# EAGLE design Mainsch (EAGLE 9.6.2)
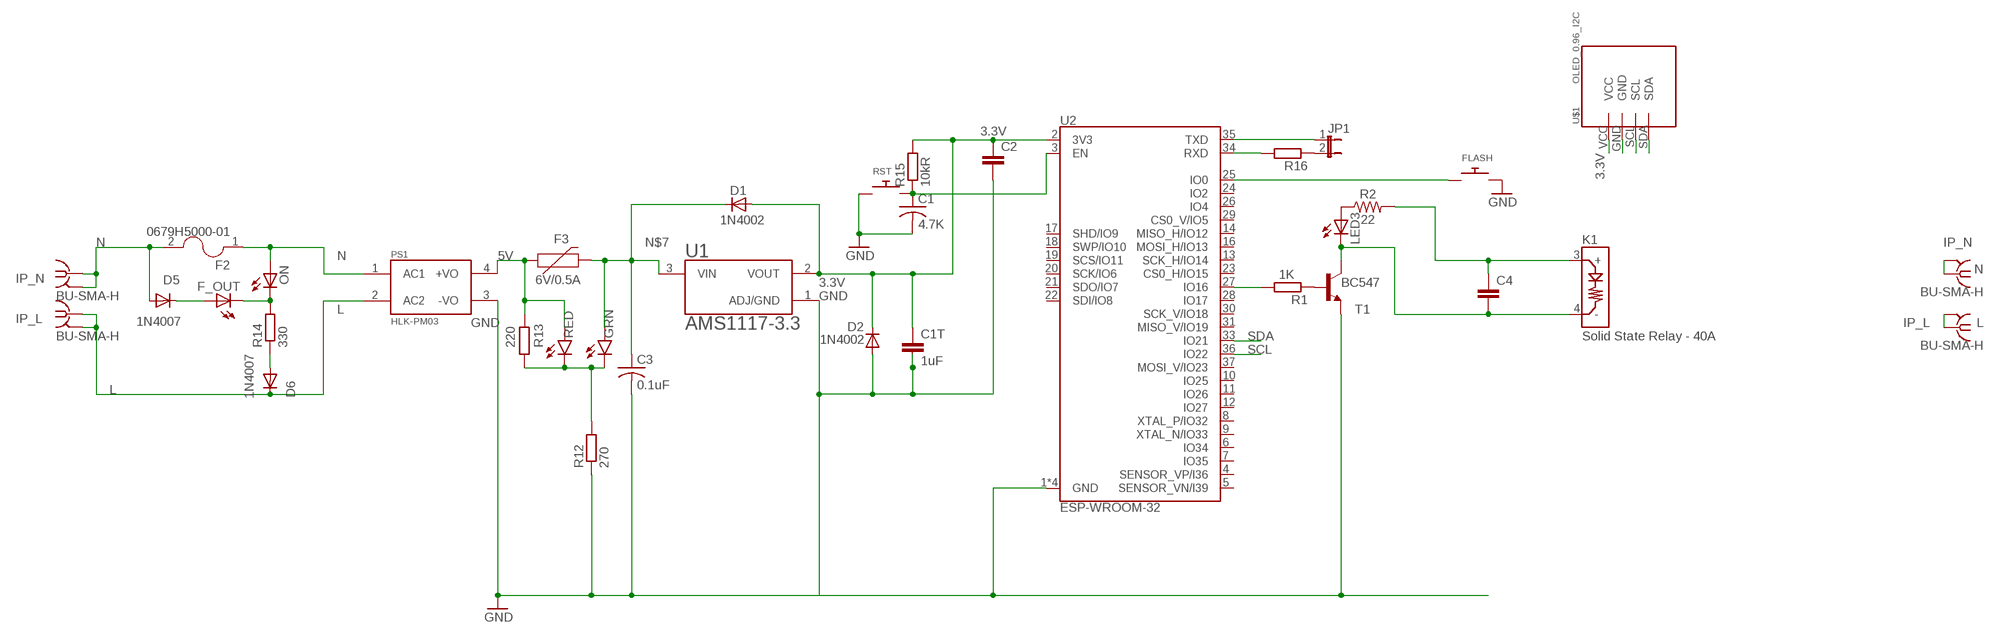
[diagram p0: schematic, sheet 1]

## Parts
C1  4.7K  C-USC0805K  [C0805K]
C1T  1uF  C-EUC0805  [C0805]
C2  C-EUC0805  [C0805]
C3  0.1uF  C-USC0805K  [C0805K]
C4  C-EUC0805  [C0805]
D1  1N4002  1N4004  [DO41-10]
D2  1N4002  1N4004  [DO41-10]
D5  1N4007  1N4004  [DO41-10]
D6  1N4007  1N4004  [DO41-10]
F2  0679H5000-01  [FUSC6125X279N]
F3  6V/0.5A  PPTC_6V500MA-2  [1206]
F_OUT  LEDCHIPLED_1206  [CHIPLED_1206]
FLASH  SWITCH_PUSHBUTTONC&K_KSS  [BTN_CK_KSS]
GRN  LED1206  [LED-1206]
IP_L  BU-SMA-H  [BU-SMA-H]
IP_N  BU-SMA-H  [BU-SMA-H]
JP1  JP1E  [JP1]
K1  Solid State Relay - 40A  SOLID_STATE_RELAY_SSR-40DA-H  [SSR-40DA-H]
L  BU-SMA-H  [BU-SMA-H]
LED3  LEDCHIPLED_1206  [CHIPLED_1206]
N  BU-SMA-H  [BU-SMA-H]
ON  LEDCHIPLED_1206  [CHIPLED_1206]
PS1  HLK-PM03  [CONV_HLK-PM03]
R1  1K  R-EU_R1206  [R1206]
R2  22  22OHM-0603-1/10W-1%  [0603]
R12  270  R-EU_R0805  [R0805]
R13  220  R-EU_R0805  [R0805]
R14  330  R-EU_R0805  [R0805]
R15  10kR  R-EU_R0805  [R0805]
R16  R-EU_R0805  [R0805]
RED  LED1206  [LED-1206]
RST  SWITCH_PUSHBUTTONC&K_KSS  [BTN_CK_KSS]
T1  BC547  [TO92]
U1  AMS1117-3.3  [SOT229P700X180-4N]
U2  ESP-WROOM-32  [ESP-WROOM-32]
U$1  OLED_0.96_I2C  [OLED_0.96_I2C]

## Nets
3.3V [dc]: C1T.1 C2.1 D1.A D2.C R15.2 U1.2(VOUT) U2.2(3V3) U$1.VCC
5V [dc]: F3.1 PS1.4(+VO) R13.2 RED.A
GND [dc]: C1.2 C1T.2 C2.2 C3.2 D2.A FLASH.P$2 PS1.3(-VO) R12.1 RST.P$1 T1.1(E) U1.1(ADJ/GND) U2.1(GND) U2.15(GND) U2.38(GND) U2.GND U$1.GND
IP_L [ac]: L.1 L.2 L.3 L.4 L.5
IP_N [ac]: N.1 N.2 N.3 N.4 N.5
L [ac]: D6.C IP_L.1 IP_L.2 IP_L.3 IP_L.4 IP_L.5 PS1.2(AC2)
N [ac]: D5.A F2.1 F2.2 IP_N.1 IP_N.2 IP_N.3 IP_N.4 IP_N.5 ON.A PS1.1(AC1)
N$1: JP1.2 R16.1
N$2: C4.2 K1.4(-) LED3.C T1.3(C)
N$3: R1.2 U2.27(IO16)
N$4: LED3.A R2.1
N$5: D6.A R14.1
N$7: C3.1 D1.C F3.2 GRN.A U1.3(VIN)
N$9: JP1.1 U2.35(TXD)
N$11: R16.2 U2.34(RXD)
N$14: FLASH.P$1 U2.25(IO0)
N$16: C1.1 R15.1 RST.P$2 U2.3(EN)
N$17: R1.1 T1.2(B)
N$18: F_OUT.C ON.C R14.2
N$21: D5.C F_OUT.A
N$24: GRN.C R12.2 R13.1 RED.C
N$25: C4.1 K1.3(+) R2.2
SCL: U2.36(IO22) U$1.SCL
SDA: U2.33(IO21) U$1.SDA
Unconnected: U2.4(SENSOR_VP/I36) U2.5(SENSOR_VN/I39) U2.6(IO34) U2.7(IO35) U2.8(XTAL_P/IO32) U2.9(XTAL_N/IO33) U2.10(IO25) U2.11(IO26) U2.12(IO27) U2.13(SCK_H/IO14) U2.14(MISO_H/IO12) U2.16(MOSI_H/IO13) U2.17(SHD/IO9) U2.18(SWP/IO10) U2.19(SCS/IO11) U2.20(SCK/IO6) U2.21(SDO/IO7) U2.22(SDI/IO8) U2.23(CS0_H/IO15) U2.24(IO2) U2.26(IO4) U2.28(IO17) U2.29(CS0_V/IO5) U2.30(SCK_V/IO18) U2.31(MISO_V/IO19) U2.37(MOSI_V/IO23)

## Library data of the parts
C1 C3 = adafruit:C-US: CAPACITOR, American symbol
C1T C2 C4 = rcl:C-EU: CAPACITOR, European symbol
D1 D2 = diode:1N4004: DIODE
D5 D6 = adafruit:1N4004: DIODE
F2 = ac_fuse:0679H5000-01: 2410 SMT Fuse | Quick Acting | 250mA | Higher AC Voltage Check prices <https://pricing.snapeda.com/parts/0679H5000-01/Bel%20Fuse/view-part?ref=eda>; AVAILABILITY: Good; DESCRIPTION: 2410 SMT Fuse | Quick Acting | 5A | Higher AC Voltage; MF: Bel Fuse; MP: 0679H5000-01; PACKAGE: SMD-2 Bel Fuse; PRICE: None; PURCHASE-URL: https://pricing.snapeda.com/search/part/0679H5000-01/?ref=eda
F3 = SparkFun-Fuses:PPTC: Resettable Fuse PPTC Resettable Fuse. Really a sort of resistor with a polymeric positive temperature coefficient whose resistance increases dramatically with an increase in temperature. When heated by the power passing through the resistance rises causing the current to be limited, protecting the circuit. This is achieved by the transition of the polymer from a crystalline to an amorphous state where the conductive carbon separates breaking the conductive pathways found in the cool crystalline structure. When a PPTC cools back down it resumes conducting letting the circuit turn back on. SparkFun Products: SparkFun RedBoard - Programmed with Arduino <https://www.sparkfun.com/products/12757> Pro Micro - 5V/16MHz <https://www.sparkfun.com/products/12640> Arduino Pro 328 - 5V/16MHz <https://www.sparkfun.com/products/10915> MP3 Trigger <https://www.sparkfun.com/products/13720>; PROD_ID: RES-08585
F_OUT LED3 ON = adafruit:LED: LED OSRAM: - CHIPLED LG R971, LG N971, LY N971, LG Q971, LY Q971, LO R971, LY R971 LH N974, LH R974 LS Q976, LO Q976, LY Q976 LO Q996 - Hyper CHIPLED LW Q18S LB Q993, LB Q99A, LB R99A - SideLED LS A670, LO A670, LY A670, LG A670, LP A670 LB A673, LV A673, LT A673, LW A673 LH A674 LY A675 LS A676, LA A676, LO A676, LY A676, LW A676 LS A679, LY A679, LG A679 - Hyper Micro SIDELED® LS Y876, LA Y876, LO Y876, LY Y876 LT Y87S - SmartLED LW L88C, LW L88S LB L89C, LB L89S, LG L890 LS L89K, LO L89K, LY L89K LS L896, LA L896, LO L896, LY L896 - TOPLED LS T670, LO T670, LY T670, LG T670, LP T670 LSG T670, LSP T670, LSY T670, LOP T670, LYG T670 LG T671, LOG T671, LSG T671 LB T673, LV T673, LT T673, LW T673 LH T674 LS T676, LA T676, LO T676, LY T676, LB T676, LH T676, LSB T676, LW T676 LB T67C, LV T67C, LT T67C, LS T67K, LO T67K, LY T67K, LW E67C LS E67B, LA E67B, LO E67B, LY E67B, LB E67C, LV E67C, LT E67C LW T67C LS T679, LY T679, LG T679 LS T770, LO T770, LY T770, LG T770, LP T770 LB T773, LV T773, LT T773, LW T773 LH T774 LS E675, LA E675, LY E675, LS T675 LS T776, LA T776, LO T776, LY T776, LB T776 LHGB T686 LT T68C, LB T68C - Hyper Mini TOPLED® LB M676 - Mini TOPLED Santana® LG M470 LS M47K, LO M47K, LY M47K Source: http://www.osram.convergy.de/
FLASH RST = adafruit:SWITCH_PUSHBUTTON: Buttons SOFTTOUCHSMD_SJ - Soft touch temporary push button (Super Junk Akihabara) Compatible with SKPMANE010 [Mouser: 688-SKPMAN] C&K_KSS = Digikey: KSS221GLFS
GRN RED = SparkFun-LED:LED: LED (Generic) Standard schematic elements and footprints for 5mm, 3mm, 1206, and 0603 sized LEDs. Generic LEDs with no color specified.
IP_L IP_N L N = con-coax:BU-SMA-H: FEMALE SMA CONNECTOR Radiall; OC_FARNELL: unknown; OC_NEWARK: unknown
JP1 = jumper:JP1E: JUMPER
K1 = SparkFun-DiscreteSemi:SOLID_STATE_RELAY_SSR-40DA-H: Fotek SSR-40DA-H DC->AC Solid State Relay This particular SSR can switch current loads of up to 40A with a 3-32V DC input and a zero cross trigger control method. Each one of these relays is equipped with four screw terminals (for use with ring or fork connectors) and a plastic cover that slides over the top of the relay to protect the terminals.; PROD_ID: COMP-15116, CONN-08399, 2 x HW-15038
PS1 = HLK-PM03:HLK-PM03: AC DC 3W power module; AVAILABILITY: Unavailable; MF: Hi-link; MP: HLK-PM03; PACKAGE: Package; PRICE: None
R1 = resistor:R-EU_: RESISTOR, European symbol
R2 = SparkFun-Resistors:22OHM: 22Ω resistor A resistor is a passive two-terminal electrical component that implements electrical resistance as a circuit element. Resistors act to reduce current flow, and, at the same time, act to lower voltage levels within circuits. - Wikipedia; PROD_ID: RES-08698
R12-R16 = rcl:R-EU_: RESISTOR, European symbol; SPICEPREFIX: R
T1 = transistor:BC547: NPN TRANSISTOR
U1 = AMS1117-3.3:AMS1117-3.3: Sot223/Pkg 1-Amp 3.3-Volt Low Drop Out Voltage Regulatator; AVAILABILITY: Unavailable; DESCRIPTION: LDO Voltage Regulators 800MA LDO LINEAR REG; MF: AMD; MP: AMS1117-3.3; PACKAGE: None; PRICE: None
U2 = SparkFun-RF:ESP-WROOM-32; PROD_ID: IC-13849
U$1 = oled_0_96:OLED_0.96_I2C

## Net classes
0 default: width 0.381 mm
1 dc: width 0.406 mm
2 ac: width 3.556 mm

## Board
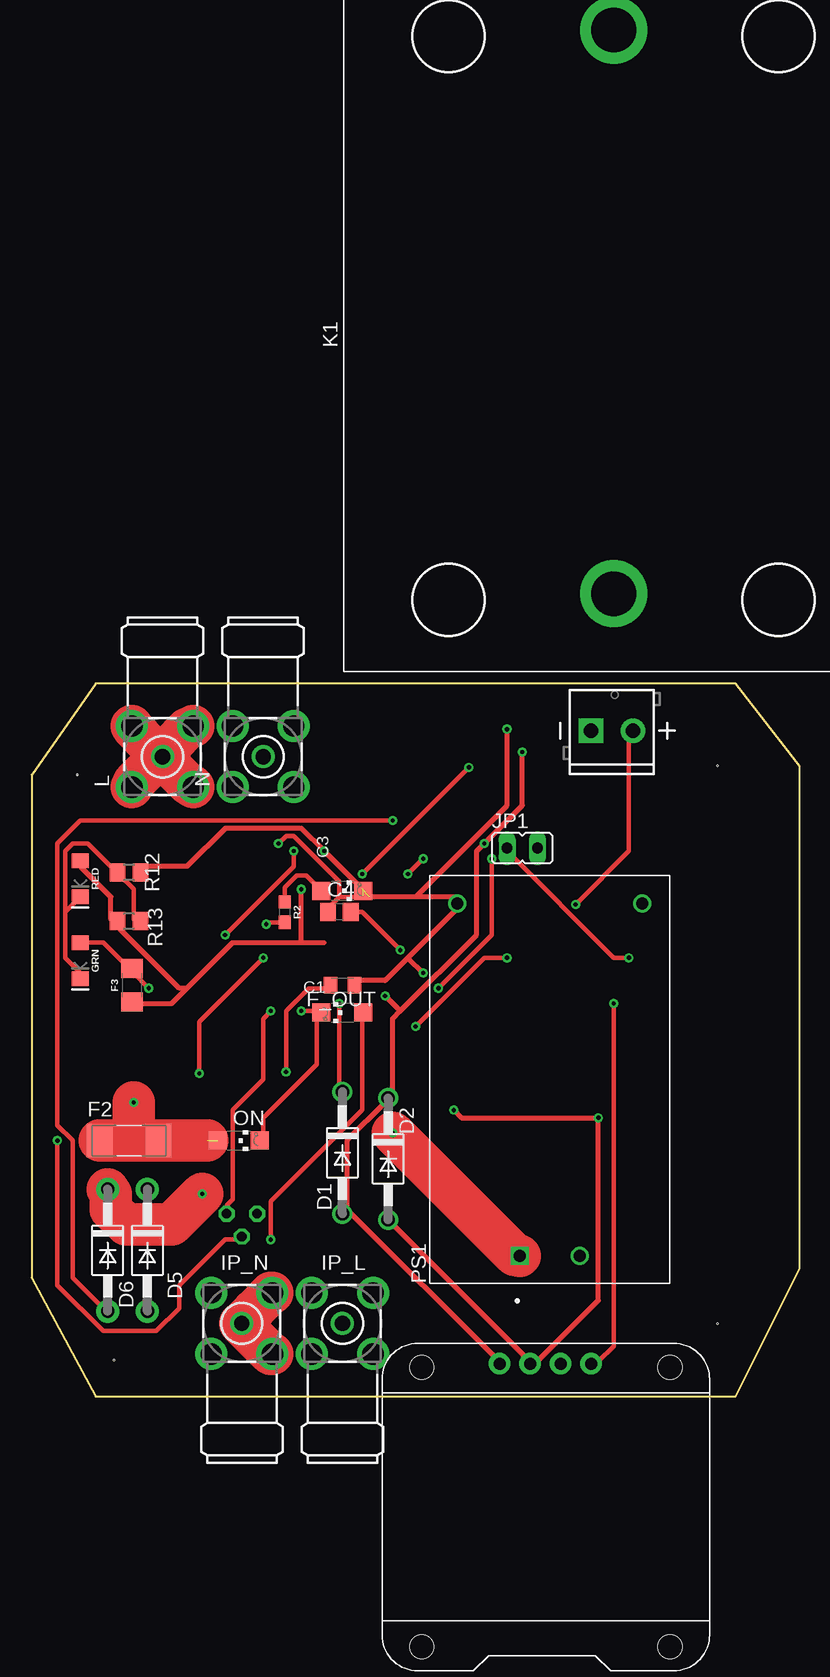
[diagram p1: board, top side]
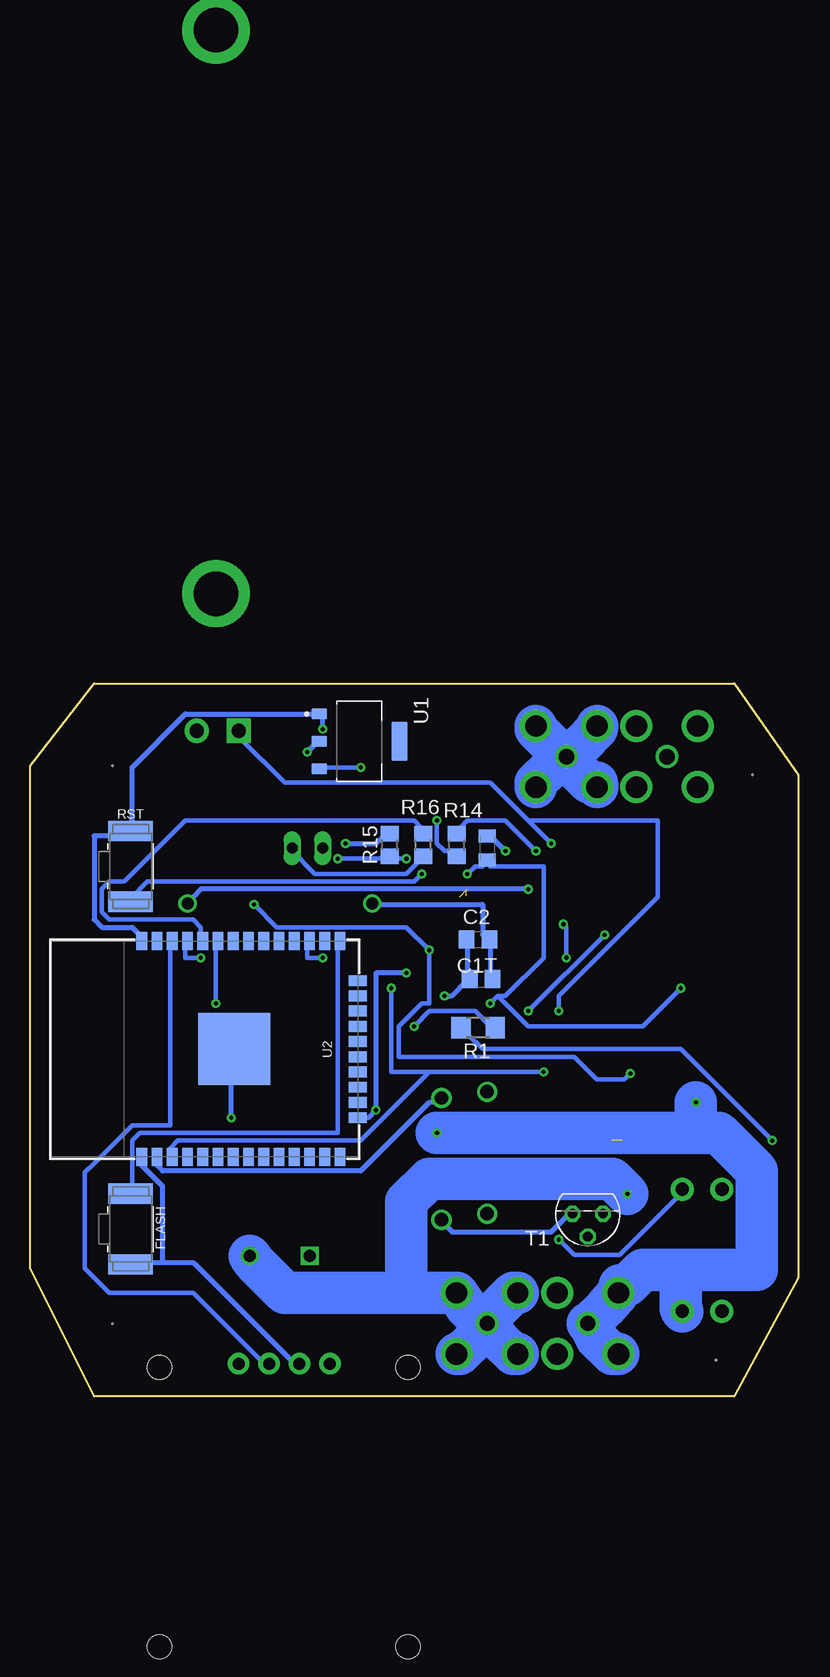
[diagram p2: board, bottom side, seen from below]

Size 64.01 x 59.44 mm. Coordinates in mm from the lower left corner, seen from the top.
Outline: 0,9.91 5.33,0 58.67,0 64.01,10.67 64.01,52.58 58.67,59.44 5.33,59.44 0,51.82 0,9.91
Copper layers (1*16): Top 0.035mm / dielectric 1.5mm / Bottom 0.035mm
Design rules "default": minimum track width 6mil, minimum drill 0.35mm, track to track 6mil, track to pad 6mil, pad to pad 6mil, via to via 6mil, smd to smd 6mil, copper to edge 40mil, drill to drill 6mil, minimum pad ring 10mil, minimum via ring 8mil, stop-mask expansion 4mil, vias tented up to drill 0mil, thermal gap 10mil
Holes 0.11 mm at 6.86,3.05 3.81,51.82 57.15,52.58 57.15,6.1

### Footprints (pad centres in the part's own frame; a part is rotated, then mirrored left to right if it is on the bottom)
C0805K = smd 1.1 x 1.4: 1 -1,0; 2 1,0
C0805 = smd 1.3 x 1.5: 1 -0.95,0; 2 0.95,0
DO41-10 = drill 1.118: A 5.08,0; C -5.08,0
DO41-10' = drill 1.118 pad 1.93: A 5.08,0; C -5.08,0
FUSC6125X279N = smd 2.15 x 2.8: 1 -2.455,0; 2 2.455,0
1206 = smd 1.6 x 1.8: 1 -1.4,0; 2 1.4,0
CHIPLED_1206 = smd 1.5 x 1.5: A 0,-1.75; C 0,1.75
BTN_CK_KSS = smd 1.7 x 3.7: P$1 -2.95,0; P$2 2.95,0
LED-1206 = smd 1.2 x 1.4: A -1.5,0; C 1.5,0
BU-SMA-H = drill 1.27: 1 0,0 | drill 1.778: 2 -2.55,2.55; 3 2.55,2.55; 4 2.55,-2.55; 5 -2.55,-2.55
JP1 = drill 0.914 long: 1 0,-1.27; 2 0,1.27
SSR-40DA-H = drill 1.2 pad 2.032: 3 -34.925,-1.595 | drill 1.2 pad 2.032 square: 4 -34.925,1.905 | drill 3.73 pad 5.6: H1 -23.5,0; H2 23.49,0
CONV_HLK-PM03 = drill 1 square: 1 -14.7,2.5 | drill 1: 2 -14.7,-2.5; 3 14.7,7.7; 4 14.7,-7.7
R1206 = smd 1.6 x 1.803: 1 -1.422,0; 2 1.422,0
0603 = smd 1.1 x 1: 1 -0.85,0; 2 0.85,0
R0805 = smd 1.3 x 1.5: 1 -0.95,0; 2 0.95,0
TO92 = drill 0.813 octagon: 1 1.27,0; 2 0,1.905; 3 -1.27,0
SOT229P700X180-4N = smd 0.93 x 1.31: 1 -2.29,-3.345; 2 0,-3.345; 3 2.29,-3.345 | smd 3.24 x 1.31: 4 0,3.345
ESP-WROOM-32 = smd 0.9 x 1.5: 1 7.7,9; 2 6.43,9; 3 5.16,9; 4 3.89,9; 5 2.62,9; 6 1.35,9; 7 0.08,9; 8 -1.19,9; 9 -2.46,9; 10 -3.73,9; 11 -5,9; 12 -6.27,9; 13 -7.54,9; 14 -8.81,9; 25 -8.81,-9; 26 -7.54,-9; 27 -6.27,-9; 28 -5,-9; 29 -3.73,-9; 30 -2.46,-9; 31 -1.19,-9; 32 0.08,-9; 33 1.35,-9; 34 2.62,-9; 35 3.89,-9; 36 5.16,-9; 37 6.43,-9; 38 7.7,-9 | smd 1.5 x 0.9: 15 -10.3,5.715; 16 -10.3,4.445; 17 -10.3,3.175; 18 -10.3,1.905; 19 -10.3,0.635; 20 -10.3,-0.635; 21 -10.3,-1.905; 22 -10.3,-3.175; 23 -10.3,-4.445; 24 -10.3,-5.715 | smd 6 x 6: GND 0,0
OLED_0.96_I2C = drill 1 pad 1.778: GND -1.63,11.63; SCL 0.91,11.63; SDA 3.45,11.63; VCC -4.17,11.63 | hole 2: -10.67,-11.97; 10.03,-11.97; 10.03,11.33; -10.67,11.33

### Placement (x,y rotation side)
C1  25.91,34.29 0 top
C1T  26.42,34.8 0 bottom
C2  26.67,38.1 0 bottom
C3  25.91,45.72 90 bottom
C4  25.65,40.39 180 top
D1  25.91,20.32 270 top
D2  29.72,19.81 270 top
D5  1N4007  [DO41-10']  9.65,12.19 270 top
D6  1N4007  [DO41-10']  6.35,12.19 270 top
F2  8.13,21.34 0 top
F3  8.38,34.29 90 top
F_OUT  25.91,32 90 top
FLASH  55.63,13.97 270 bottom
GRN  4.06,36.32 270 top
IP_L  25.91,6.1 270 top
IP_N  17.53,6.1 270 top
JP1  40.89,45.72 270 top
K1  48.51,90.42 90 top
L  10.92,53.34 90 top
LED3  25.91,42.16 270 top
N  19.3,53.34 90 top
ON  17.27,21.34 270 top
PS1  43.18,26.42 90 top
R1  26.67,30.73 0 bottom
R2  21.08,40.39 270 top
R12  8.13,43.69 180 top
R13  8.13,39.62 180 top
R14  28.45,45.97 90 bottom
R15  34.04,45.97 90 bottom
R16  31.24,45.97 90 bottom
RED  4.06,43.18 270 top
RST  55.63,44.2 270 bottom
T1  17.53,15.24 180 bottom
U1  36.58,54.61 270 bottom
U2  46.99,28.96 180 bottom
U$1  43.18,-8.89 0 top

### Tracks (layer width: path | path; a pad name or v marks a point on that pad's centre or on a via)
3.3V  (via drill 0.35)
  Top 0.406: v40.89,53.72 40.89,49.28 v37.72,46.1 37.08,45.47 37.08,38.48 30.73,32.13 | 30.73,32.13 30.1,31.5 30.1,25.15 D2.C 29.46,24.51 26.29,21.34 26.29,15.62 | 30.73,32.13 v29.46,33.4 | 26.29,15.62 38.99,2.92 U$1.VCC | 26.29,15.62 D1.A
  Bottom 0.406: C2.1 27.56,37.85 27.56,35.31 C1T.1 27.56,34.67 28.83,33.4 v29.46,33.4 | v40.89,53.72 40.26,54.36 U1.2 | U2.2 53.59,19.43 52.96,18.8 36.45,18.8 30.73,24.51 30.1,24.51 D2.C | v37.72,46.1 35.18,46.1 34.54,46.74 R15.2
5V  (via drill 0.35)
  Top 0.406: RED.A 4.06,44.2 6.6,41.66 6.6,39.75 R13.2 7.24,39.12 12.32,34.04 12.95,34.04 | 22.48,37.85 16.76,37.85 12.95,34.04 | 22.48,37.85 24.38,37.85 | 12.95,34.04 11.68,32.77 8.51,32.77 F3.1 | 22.48,37.85 v22.48,42.29
  Bottom 0.406: v22.48,42.29 49.78,42.29 50.42,41.66 PS1.4
GND  (via drill 0.35)  (1 unrouted)
  Top 0.406: D2.A 41.53,2.92 U$1.GND 42.16,2.92 47.24,8 v47.24,23.24 35.81,23.24 v35.18,23.88 | 27.56,42.29 v24.38,45.47 22.48,47.37 16.13,47.37 12.95,44.2 9.14,44.2 R12.1 | 31.37,36.58 35.81,41.02 PS1.3 35.18,41.66 32,41.66 | 31.37,36.58 29.46,34.67 26.92,34.67 C1.2 | 31.37,36.58 v32.64,35.31 | 32,41.66 28.19,41.66 | v39.62,55.63 39.62,49.28 32,41.66
  Bottom 0.406: T1.1 19.3,14.99 20.57,13.72 28.83,13.72 29.46,14.35 D2.A | 52.96,11.18 52.96,17.53 54.86,19.43 U2.1 | 52.96,11.18 55.5,11.18 FLASH.P$2 | 52.96,11.18 50.42,11.18 42.16,2.92 U$1.GND | v47.24,23.24 47.24,28.96 U2.GND | U2.38 54.86,38.48 55.5,39.12 58.04,39.12 58.67,39.75 58.67,46.74 56.13,46.74 RST.P$1 55.5,47.37 55.5,52.45 51.05,56.9 40.26,56.9 U1.1 39.62,56.9 v39.62,55.63 | v24.38,45.47 25.65,46.74 C3.2 | C1T.2 25.65,35.31 25.65,37.85 C2.2 26.29,38.48 26.29,41.02 35.18,41.02 PS1.3 | U2.15 35.81,23.24 v35.18,23.88 35.18,35.31 v32.64,35.31
IP_L
  Top 3.556: 11.05,53.09 12.95,51.18 L.5 | 11.05,53.09 L.1 9.78,54.36 8.51,55.63 L.3 | L.2 8.51,51.18 9.78,52.45 11.05,53.09 | L.4 12.95,55.63 11.68,54.36 11.05,53.09
IP_N
  Bottom 3.556: 19.3,53.09 17.4,51.18 16.76,51.18 N.2 | 19.3,53.09 N.1 | N.3 16.76,55.63 18.03,54.36 N.1 | N.5 21.84,51.18 20.57,52.45 19.3,53.09 | N.4 21.84,55.63 20.57,54.36 N.1
L  (via drill 0.35)
  Top 3.556: v14.22,16.89 11.68,14.35 7.87,14.35 6.6,15.62 6.6,16.89 D6.C
  Bottom 3.556: 32.64,8.64 28.83,8.64 IP_L.2 27.56,7.37 26.29,6.1 | 32.64,8.64 42.8,8.64 45.34,11.18 PS1.2 | 26.29,6.1 IP_L.1 | v14.22,16.89 15.49,18.16 30.73,18.16 32.64,16.26 32.64,8.64 | IP_L.4 23.75,3.56 25.02,4.83 IP_L.1 | IP_L.5 23.75,8.64 25.02,7.37 IP_L.1 | IP_L.3 28.19,3.56 26.92,4.83 26.29,6.1
N  (via drill 0.35)  (1 unrouted)
  Top 3.556: 8.51,21.34 F2.2 14.64,21.34 | 8.51,21.34 F2.1 | v30.1,21.97 40.26,11.81 PS1.1 | v8.51,24.51 8.51,21.34 | IP_N.3 19.94,3.56 17.4,6.1 IP_N.1 18.67,7.37 19.94,8.64 IP_N.2
  Bottom 3.556: 8.51,21.97 6.6,21.97 3.43,18.8 3.43,10.54 9.78,10.54 | 8.51,21.97 v30.1,21.97 | 9.78,10.54 12.95,10.54 14.22,9.27 14.86,9.27 IP_N.5 16.13,7.37 17.4,6.1 | 17.4,6.1 IP_N.1 | 9.78,10.54 9.78,7.37 D5.A | v8.51,24.51 8.51,21.97 | IP_N.4 15.49,3.56 16.76,4.83 17.4,6.1
N$1
  Bottom 0.381: R16.1 31.37,44.83 32.64,43.56 40.26,43.56 42.16,45.47 JP1.2
N$2  (via drill 0.35)  (1 unrouted)
  Top 0.381: 25.65,41.66 25.02,41.02 25.02,40.39 C4.2 | 25.65,41.66 25.65,42.93 21.84,46.74 21.21,46.74 v20.57,46.1 | v19.94,32.13 19.3,31.5 19.3,26.42 16.76,23.88 16.76,16.43 16.26,15.92 T1.3 | 25.65,41.66 27.15,41.66 27.24,41.75 27.65,41.75
  Bottom 0.381: 22.48,48.01 25.65,51.18 42.8,51.18 46.61,54.99 K1.4 | 22.48,48.01 v20.57,46.1 | v19.94,32.13 19.94,33.4 11.68,41.66 11.68,48.01 22.48,48.01
N$3  (via drill 0.35)
  Top 0.381: v39.62,36.58 37.72,36.58 v32,30.86
  Bottom 0.381: v39.62,36.58 40.89,36.58 40.89,37.85 U2.27 | v32,30.86 30.73,32.13 26.92,32.13 25.65,30.86 R1.2
N$4
  Top 0.381: R2.1 21.08,42.42 22.1,43.43 22.89,43.43 LED3.A
N$5  (via drill 0.35)
  Top 0.381: v30.1,48.01 4.06,48.01 2.16,46.1 2.16,22.61 3.43,21.34 3.43,9.91 5.97,7.37 D6.A
  Bottom 0.381: v30.1,48.01 30.1,46.1 29.46,45.47 28.83,45.47 R14.1
N$7  (via drill 0.35)
  Top 0.381: GRN.A 4.06,37.85 5.97,37.85 7.87,35.94 F3.2 8.51,35.31 v9.78,34.04 | v27.56,43.56 v36.45,52.45 | v25.65,32.77 25.65,25.78 D1.C
  Bottom 0.381: v36.45,52.45 39.62,52.45 U1.3 | v27.56,43.56 26.92,44.2 26.29,44.2 C3.1 25.65,44.2 21.21,44.2 21.21,36.58 24.38,33.4 25.02,33.4 | 25.02,33.4 v25.65,32.77 | v9.78,34.04 12.95,30.86 22.48,30.86 25.02,33.4
N$9  (via drill 0.35)
  Top 0.381: v49.78,36.58 48.51,36.58 39.62,45.47 JP1.1
  Bottom 0.381: v49.78,36.58 51.05,36.58 51.05,37.85 U2.35
N$11
  Bottom 0.381: R16.2 31.37,47.37 32,48.01 51.05,48.01 56.13,42.93 57.4,42.93 58.04,42.29 58.04,40.39 57.4,39.75 50.42,39.75 49.78,39.12 49.78,38.48 U2.34
N$14
  Bottom 0.381: U2.25 38.35,37.85 38.35,21.97 54.86,21.97 55.5,21.34 55.5,17.53 FLASH.P$1
N$16  (via drill 0.35)
  Top 0.381: v21.21,27.05 21.21,32.13 23.11,34.04 24.38,34.04 C1.1 | v38.35,44.83 38.35,38.48 v33.91,34.04 | v32.64,44.83 v31.37,43.56
  Bottom 0.381: 30.73,27.05 v21.21,27.05 | 30.73,27.05 36.45,21.34 51.69,21.34 52.32,20.7 52.32,20.07 U2.3 | v38.35,44.83 34.54,44.83 R15.1 33.91,44.83 v32.64,44.83 | v33.91,34.04 33.91,27.05 30.73,27.05 | v31.37,43.56 32,42.93 54.23,42.93 55.5,41.66 RST.P$2
N$17  (via drill 0.35)
  Top 0.381: v2.16,21.34 2.16,9.27 5.97,5.46 10.41,5.46 12.32,7.37 12.32,9.27 16.13,13.08 17.4,13.08 T1.2
  Bottom 0.381: v2.16,21.34 9.78,28.96 26.29,28.96 27.56,30.23 R1.1
N$18  (via drill 0.35)
  Top 0.381: ON.C 19.3,21.34 19.3,23.24 23.75,27.69 23.75,31.5 F_OUT.C 23.75,32.13 v22.48,32.13 | v21.84,45.47 21.84,44.2 v16.13,38.48
  Bottom 0.381: v21.84,45.47 24.38,48.01 27.56,48.01 28.19,47.37 R14.2 | v22.48,32.13 v16.13,38.48
N$21  (via drill 0.35)
  Top 0.381: v19.94,13.08 19.94,16.26 27.56,23.88 27.56,31.5 F_OUT.A
  Bottom 0.381: v19.94,13.08 18.67,11.81 14.86,11.81 9.78,16.89 D5.C
N$24
  Top 0.381: R13.1 8.51,39.75 8.51,42.29 7.24,43.56 R12.2 6.6,44.2 4.7,46.1 3.43,46.1 2.79,45.47 2.79,40.39 | 2.79,40.39 2.79,36.58 4.06,35.31 GRN.C | 2.79,40.39 4.06,41.66 RED.C
N$25  (via drill 0.35)
  Top 0.381: C4.1 27.56,40.39 v30.73,37.21 | v45.34,41.02 49.78,45.47 49.78,54.99 K1.3 | v13.97,26.92 13.97,31.24 v19.3,36.58 | v19.56,39.37 19.72,39.54 R2.2
  Bottom 0.381: v45.34,41.02 43.43,39.12 32.64,39.12 v30.73,37.21 30.73,32.77 31.37,32.77 33.27,30.86 33.27,28.32 18.67,28.32 16.76,26.42 14.48,26.42 v13.97,26.92 | v19.3,36.58 19.3,39.12 v19.56,39.37
SCL
  Bottom 0.381: U2.36 52.32,37.85 52.32,22.61 55.5,22.61 58.48,19.62 58.67,19.43 59.44,18.67 59.44,10.67 57.4,8.64 50.42,8.64 44.7,2.92 U$1.SCL
SDA  (via drill 0.35)
  Top 0.381: v48.51,32.77 48.51,4.19 47.24,2.92 U$1.SDA
  Bottom 0.381: v48.51,32.77 48.51,37.85 U2.33